# EAGLE design AC filament driver (EAGLE 9.6.1)
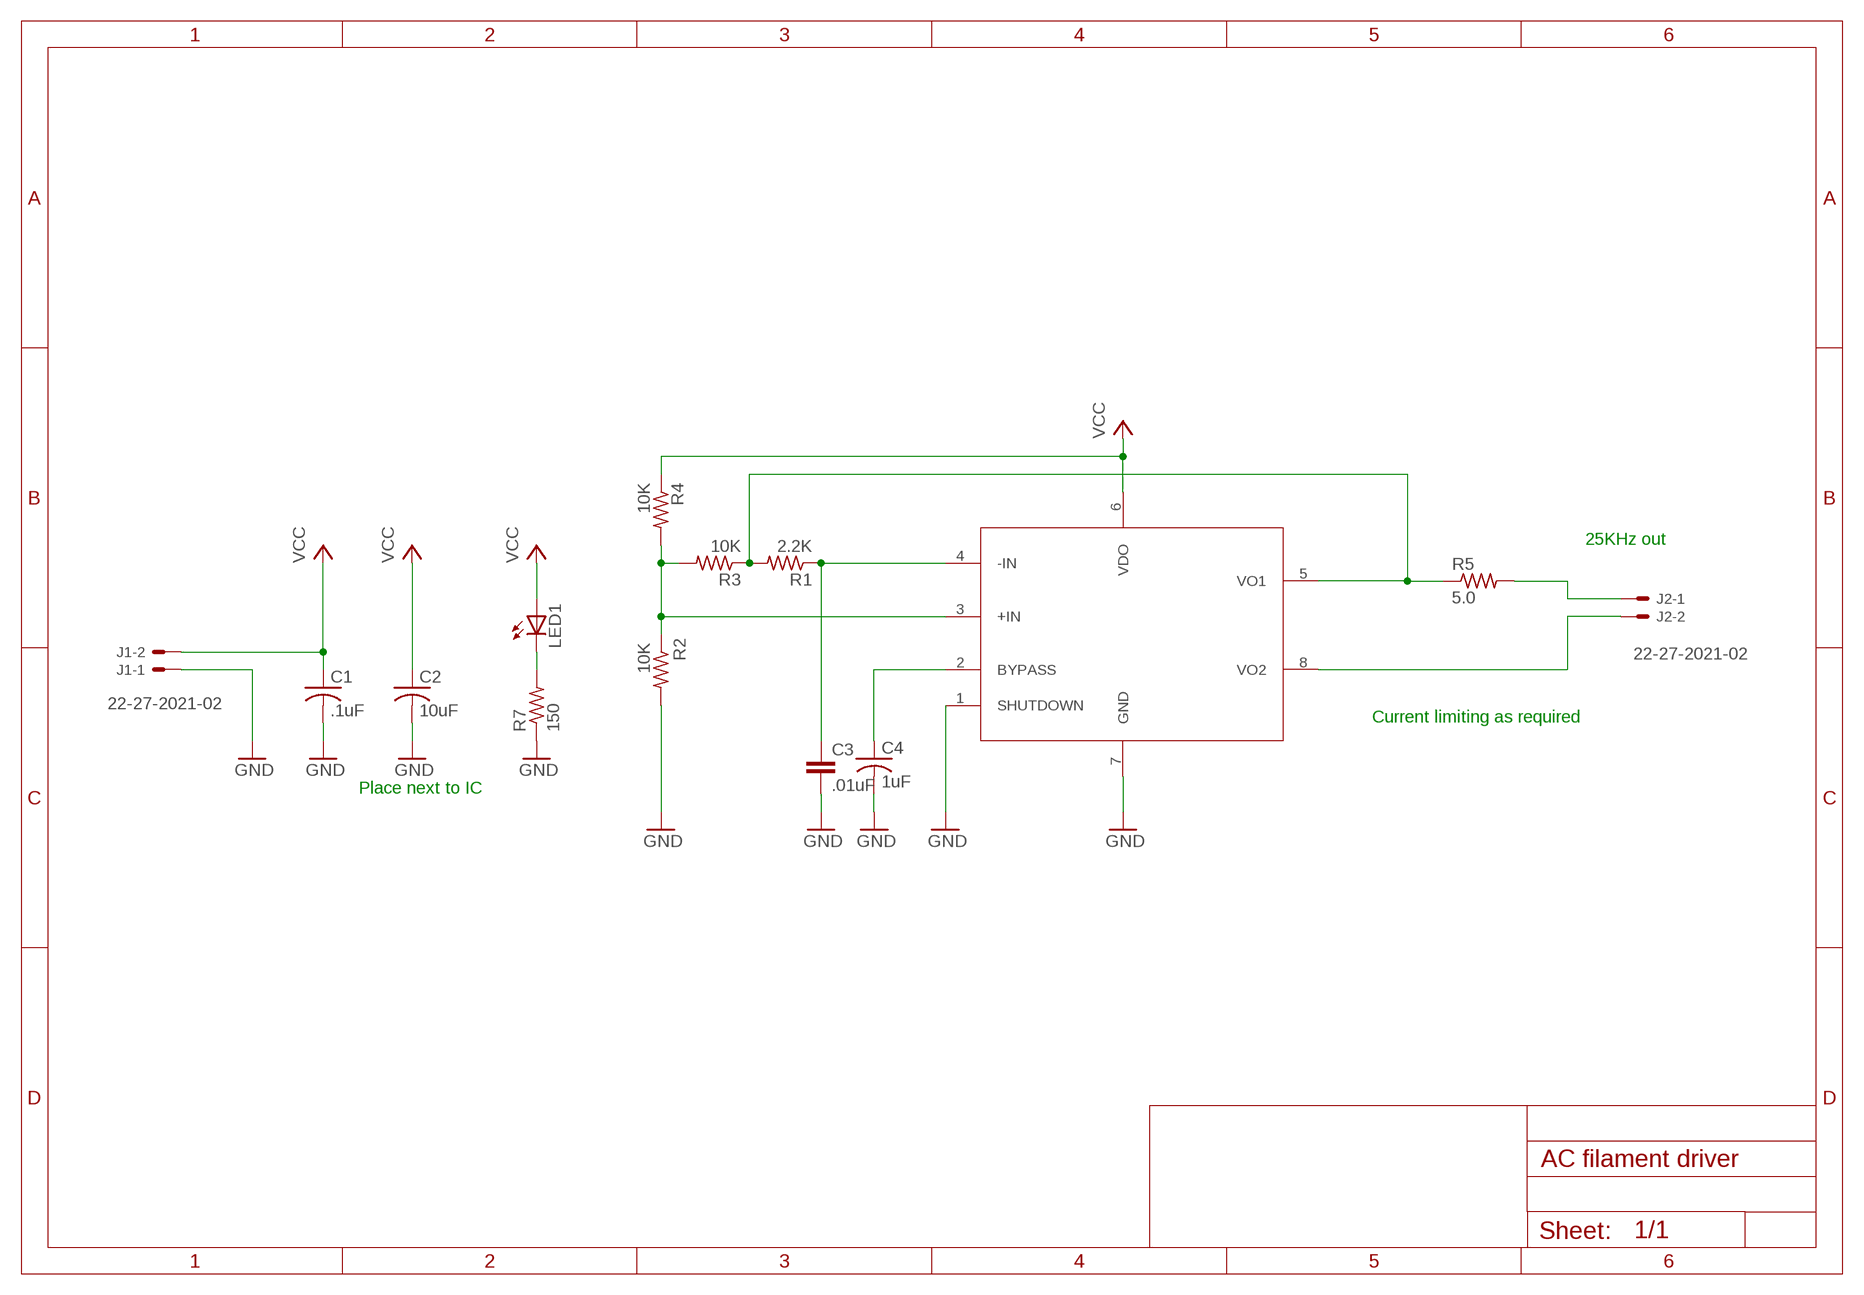
[diagram p0: schematic, sheet 1]

## Parts
C1  .1uF  C-US050-024X044  [C050-024X044]
C2  10uF  C-US025-060X050  [C025-060X050]
C3  .01uF  C-EUC0805  [C0805]
C4  1uF  C-US025-060X050  [C025-060X050]
J1  22-27-2021-02  [6410-02]
J2  22-27-2021-02  [6410-02]
LED1  LEDCHIP-LED0805  [CHIP-LED0805]
R1  2.2K  R-US_R0805  [R0805]
R2  10K  R-US_R0805  [R0805]
R3  10K  R-US_R0805  [R0805]
R4  10K  R-US_R0805  [R0805]
R5  5.0  R-US_R0805  [R0805]
R7  150  R-US_R0805  [R0805]
U1  LM9022  [SOIC127P600X175-8N]

## Nets
GND: C1.2 C2.2 C3.2 C4.2 J1.1 R2.2 R7.1 U1.1(SHUTDOWN) U1.7(GND)
N$1: LED1.C R7.2
N$2: R2.1 R3.2 R4.2 U1.3(+IN)
N$3: R1.2 R3.1 R5.1 U1.5(VO1)
N$4: C3.1 R1.1 U1.4(-IN)
N$5: C4.1 U1.2(BYPASS)
N$6: J2.1 R5.2
N$8: J2.2 U1.8(VO2)
VCC: C1.1 C2.1 J1.2 LED1.A R4.1 U1.6(VDO)

## Notes on the sheet
- 25KHz out
- Current limiting as required
- Place next to IC

## Library data of the parts
C1 = rcl:C-US: CAPACITOR, American symbol; SPICEPREFIX: C
C2 C4 = adafruit:C-US: CAPACITOR, American symbol
C3 = rcl:C-EU: CAPACITOR, European symbol; SPICEPREFIX: C
J1 J2 = con-molex:22-?-02: CONNECTOR wire to board 2.54 mm (.1 inch) pitch header; MF: MOLEX; OC_FARNELL: unknown; OC_NEWARK: unknown
LED1 = adafruit:LED: LED OSRAM: - CHIPLED LG R971, LG N971, LY N971, LG Q971, LY Q971, LO R971, LY R971 LH N974, LH R974 LS Q976, LO Q976, LY Q976 LO Q996 - Hyper CHIPLED LW Q18S LB Q993, LB Q99A, LB R99A - SideLED LS A670, LO A670, LY A670, LG A670, LP A670 LB A673, LV A673, LT A673, LW A673 LH A674 LY A675 LS A676, LA A676, LO A676, LY A676, LW A676 LS A679, LY A679, LG A679 - Hyper Micro SIDELED® LS Y876, LA Y876, LO Y876, LY Y876 LT Y87S - SmartLED LW L88C, LW L88S LB L89C, LB L89S, LG L890 LS L89K, LO L89K, LY L89K LS L896, LA L896, LO L896, LY L896 - TOPLED LS T670, LO T670, LY T670, LG T670, LP T670 LSG T670, LSP T670, LSY T670, LOP T670, LYG T670 LG T671, LOG T671, LSG T671 LB T673, LV T673, LT T673, LW T673 LH T674 LS T676, LA T676, LO T676, LY T676, LB T676, LH T676, LSB T676, LW T676 LB T67C, LV T67C, LT T67C, LS T67K, LO T67K, LY T67K, LW E67C LS E67B, LA E67B, LO E67B, LY E67B, LB E67C, LV E67C, LT E67C LW T67C LS T679, LY T679, LG T679 LS T770, LO T770, LY T770, LG T770, LP T770 LB T773, LV T773, LT T773, LW T773 LH T774 LS E675, LA E675, LY E675, LS T675 LS T776, LA T776, LO T776, LY T776, LB T776 LHGB T686 LT T68C, LB T68C - Hyper Mini TOPLED® LB M676 - Mini TOPLED Santana® LG M470 LS M47K, LO M47K, LY M47K Source: http://www.osram.convergy.de/
R1-R4 R7 = adafruit:R-US_: RESISTOR, American symbol
R5 = rcl:R-US_: RESISTOR, American symbol; SPICEPREFIX: R
U1 = RandomParts:LM9022: VFD Filament Driver; SOIC: 8

## Board
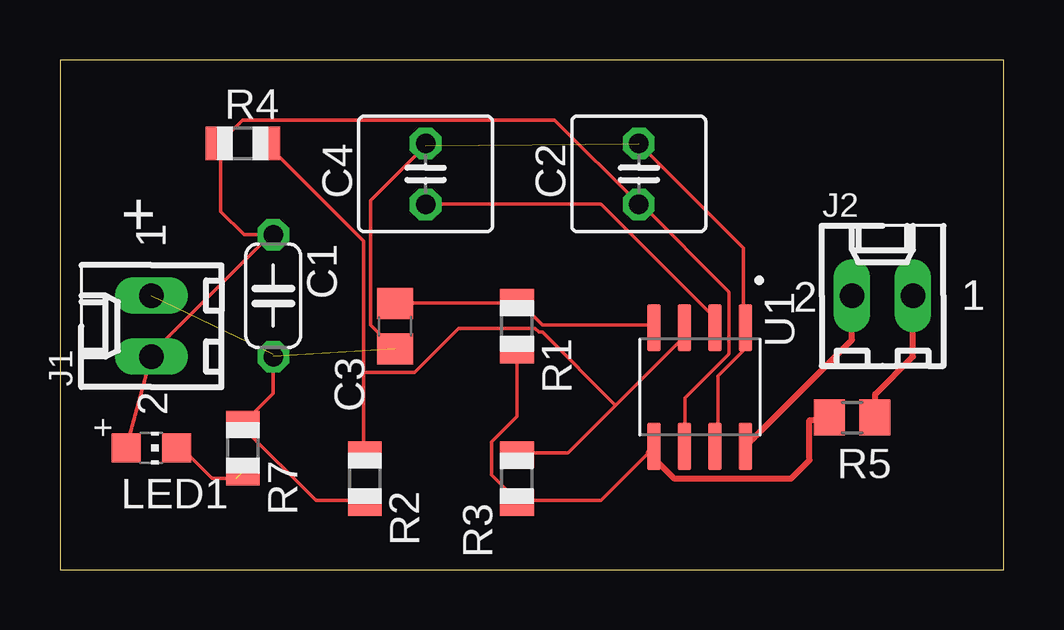
[diagram p1: board, top side]
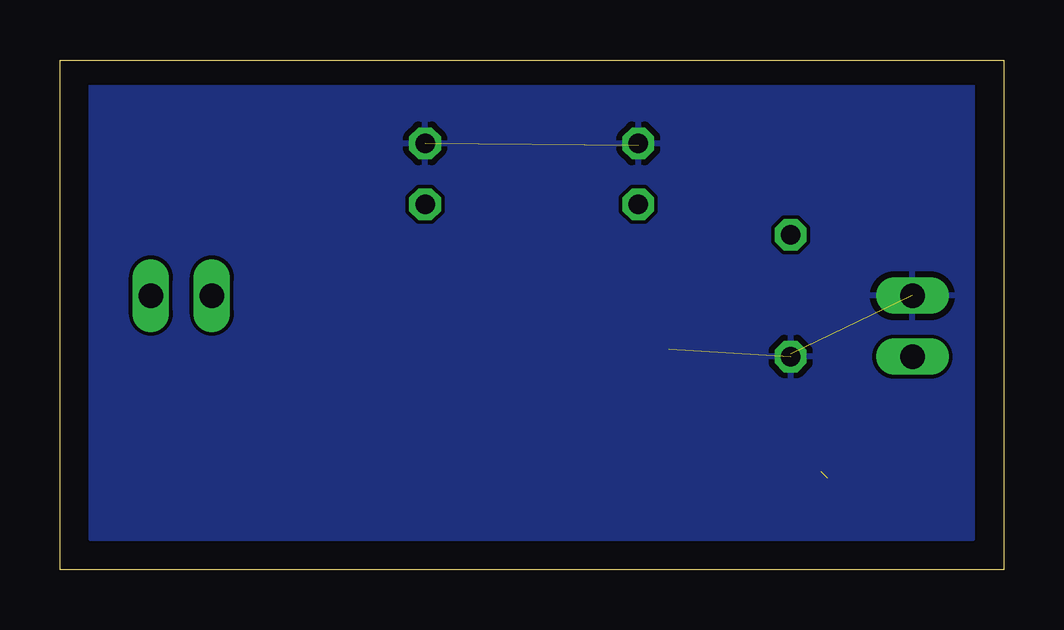
[diagram p2: board, bottom side, seen from below]

Size 39.35 x 21.26 mm. Coordinates in mm from the lower left corner, seen from the top.
Outline: 0,0 39.35,0 39.35,21.26 0,21.26 0,0
Copper layers (1*16): Top 0.035mm / dielectric 1.5mm / Bottom 0.035mm
Design rules "default": minimum track width 6mil, minimum drill 0.35mm, track to track 6mil, track to pad 6mil, pad to pad 6mil, via to via 6mil, smd to smd 6mil, copper to edge 40mil, drill to drill 6mil, minimum pad ring 10mil, minimum via ring 8mil, stop-mask expansion 4mil, vias tented up to drill 0mil, thermal gap 10mil

### Footprints (pad centres in the part's own frame; a part is rotated, then mirrored left to right if it is on the bottom)
C050-024X044 = drill 0.813 octagon: 1 -2.54,0; 2 2.54,0
C025-060X050 = drill 0.813 octagon: 1 -1.27,0; 2 1.27,0
C0805 = smd 1.3 x 1.5: 1 -0.95,0; 2 0.95,0
6410-02 = drill 1.016 long: 1 1.27,0; 2 -1.27,0
CHIP-LED0805 = smd 1.2 x 1.2: A 0,-1.05; C 0,1.05
R0805 = smd 1.1 x 1.4: 1 -1,0; 2 1,0
R0805' = smd 1.3 x 1.5: 1 -0.95,0; 2 0.95,0
SOIC127P600X175-8N = smd 1.97 x 0.57: 1 -2.475,1.905; 2 -2.475,0.635; 3 -2.475,-0.635; 4 -2.475,-1.905; 5 2.475,-1.905; 6 2.475,-0.635; 7 2.475,0.635; 8 2.475,1.905

### Placement (x,y rotation side)
C1  8.89,11.43 270 top
C2  24.13,16.51 90 top
C3  13.97,10.16 270 top
C4  15.24,16.51 90 top
J1  3.81,10.16 90 top
J2  34.29,11.43 0 top
LED1  3.81,5.08 270 top
R1  19.05,10.16 270 top
R2  12.7,3.81 270 top
R3  19.05,3.81 90 top
R4  7.62,17.78 0 top
R5  5.0  [R0805']  33.02,6.35 0 top
R7  7.62,5.08 270 top
U1  26.67,7.62 270 top

### Tracks (layer width: path | path; a pad name or v marks a point on that pad's centre or on a via)
GND  (3 unrouted)
  Top 0.152: R2.2 12.65,2.9 10.67,2.9 7.62,5.94 R7.1 8.89,7.35 C1.2 8.89,8.99 | U1.7 27.43,5.18 27.43,8.08 28.5,9.14 28.5,10.06 U1.1 28.5,10.21 28.5,13.41 C2.2 | C3.2 13.87,9.3 12.95,10.21 12.95,15.39 15.24,17.68 C4.2
  Bottom 0.152: 15.24,17.68 C4.2
  pour Bottom (isolate 0): 3.81,20.32 1.27,20.32 1.27,1.27 38.1,1.27 38.1,20.32
N$1  (1 unrouted)
  Top 0.152: LED1.C 5.08,5.08 6.35,3.81 7.35,3.81
N$2
  Top 0.152: 23.16,6.86 25.91,9.6 25.91,10.06 U1.3 | 23.16,6.86 21.18,4.88 19.05,4.88 R3.2 | 12.65,8.23 12.65,13.72 8.69,17.68 R4.2 | 12.65,8.23 12.65,4.88 R2.1 | 23.16,6.86 20.12,9.91 19.96,9.91 19.81,10.06 16.61,10.06 14.78,8.23 12.65,8.23
N$3
  Top 0.152: 19.05,2.9 22.55,2.9 24.54,4.88 | 24.54,4.88 24.69,5.03 U1.5 24.54,4.88 | R1.2 19.05,6.4 17.98,5.33 17.98,3.96 19.05,2.9 | 19.05,2.9 R3.1 | 32,6.25 R5.1
  Top 0.254: 32,6.25 31.24,6.25 31.24,4.57 30.48,3.81 25.6,3.81 24.54,4.88
N$4
  Top 0.152: C3.1 14.02,11.12 19.05,11.12 R1.1 19.05,11.28 20.12,10.21 24.69,10.21 U1.4
N$5
  Top 0.152: C4.1 22.55,15.24 27.28,10.52 27.28,10.21 U1.2
N$6
  Top 0.152: 33.98,6.4 R5.2
  Top 0.254: 33.98,6.4 33.98,7.32 35.56,8.89 J2.1
N$8
  Top 0.254: U1.8 33.02,9.59 J2.2
VCC
  Top 0.152: U1.6 26.06,5.18 26.06,7.16 27.89,8.99 27.89,11.58 24.23,15.24 C2.1 20.62,18.75 7.62,18.75 6.71,17.83 R4.1 6.71,17.68 6.71,14.94 7.67,13.97 C1.1 8.79,13.97 3.81,8.99 J1.2 LED1.A

### Text on the board
tNames: +